# Altium schematic sheet UpConverter.SchDoc
size A4; DocumentNumber: 8; SheetNumber: 8; SheetTotal: 9
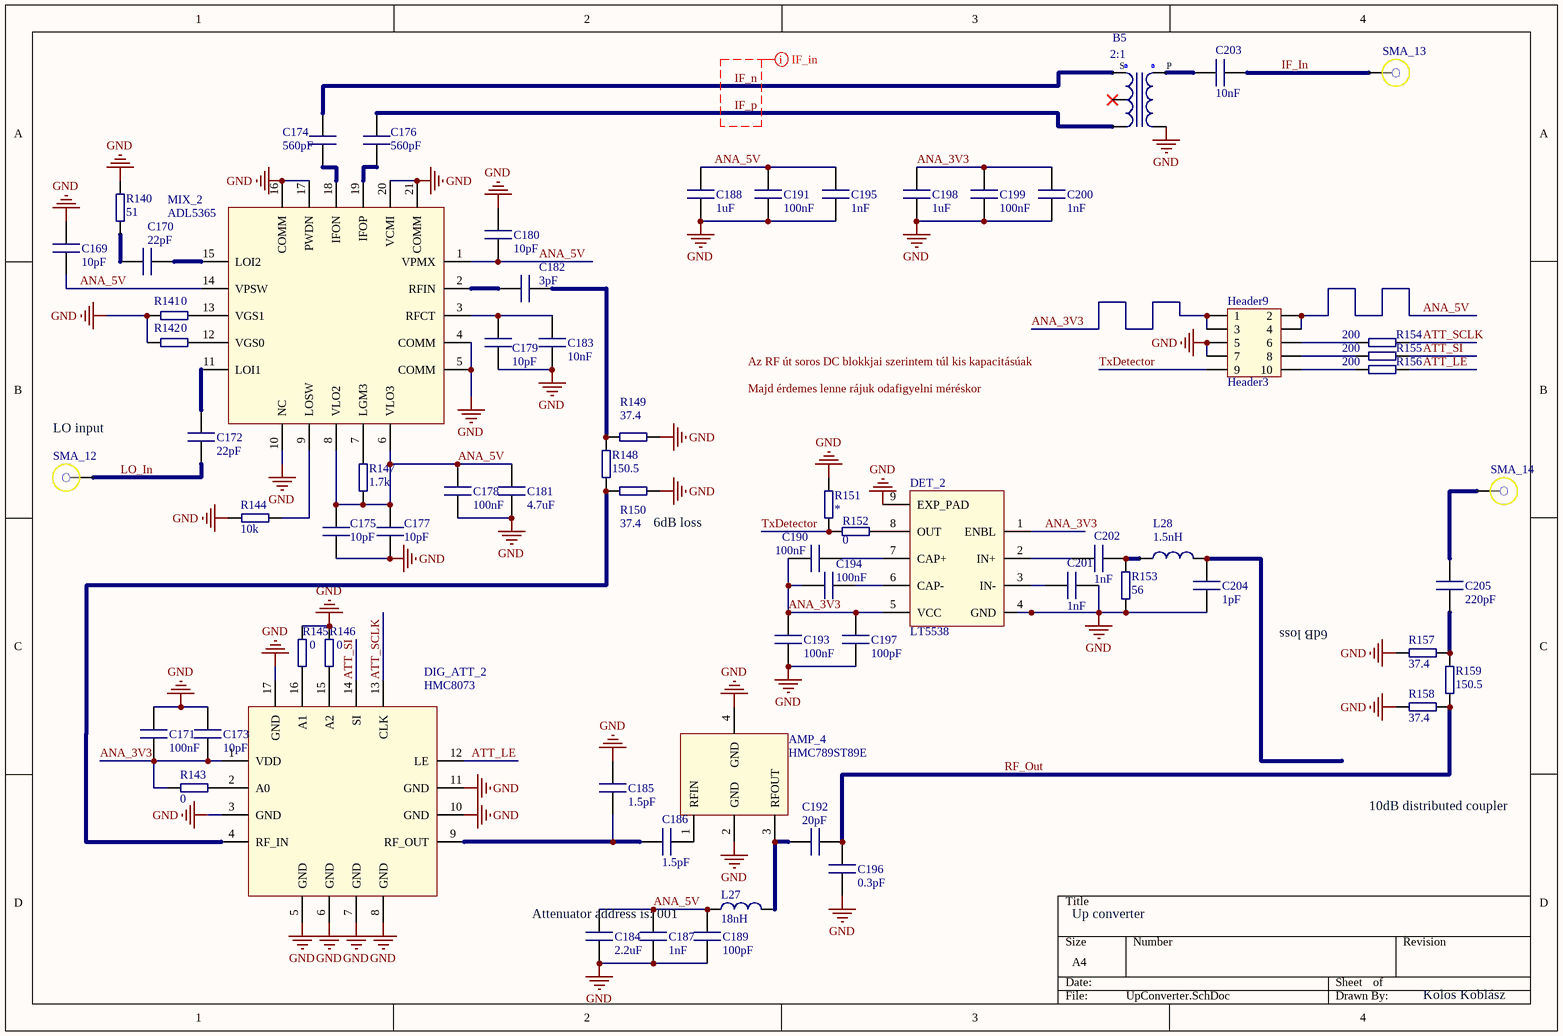
[diagram p0: UpConverter.SchDoc]

## Parts
AMP_4  HMC789ST89E
B5  ImpedanceTransformation P : S: 2:1  [Balun_Coil]  (hidden comment: Balun)
C169  value 10pF  [0805 SMD Passive]  (hidden comment: Cap1)
C170  value 22pF  [0805 SMD Passive]  (hidden comment: Cap1)
C171  value 100nF  [0805 SMD Passive]  (hidden comment: Cap1)
C172  value 22pF  [0805 SMD Passive]  (hidden comment: Cap1)
C173  value 10pF  [0805 SMD Passive]  (hidden comment: Cap1)
C174  value 560pF  [0805 SMD Passive]  (hidden comment: Cap1)
C175  value 10pF  [0805 SMD Passive]  (hidden comment: Cap1)
C176  value 560pF  [0805 SMD Passive]  (hidden comment: Cap1)
C177  value 10pF  [0805 SMD Passive]  (hidden comment: Cap1)
C178  value 100nF  [0805 SMD Passive]  (hidden comment: Cap1)
C179  value 10pF  [0805 SMD Passive]  (hidden comment: Cap1)
C180  value 10pF  [0805 SMD Passive]  (hidden comment: Cap1)
C181  value 4.7uF  [0805 SMD Passive]  (hidden comment: Cap1)
C182  value 3pF  [0805 SMD Passive]  (hidden comment: Cap1)
C183  value 10nF  [0805 SMD Passive]  (hidden comment: Cap1)
C184  value 2.2uF  [0805 SMD Passive]  (hidden comment: Cap1)
C185  value 1.5pF  [0805 SMD Passive]  (hidden comment: Cap1)
C186  value 1.5pF  [0805 SMD Passive]  (hidden comment: Cap1)
C187  value 1nF  [0805 SMD Passive]  (hidden comment: Cap1)
C188  value 1uF  [0805 SMD Passive]  (hidden comment: Cap1)
C189  value 100pF  [0805 SMD Passive]  (hidden comment: Cap1)
C190  value 100nF  [0805 SMD Passive]  (hidden comment: Cap1)
C191  value 100nF  [0805 SMD Passive]  (hidden comment: Cap1)
C192  value 20pF  [0805 SMD Passive]  (hidden comment: Cap1)
C193  value 100nF  [0805 SMD Passive]  (hidden comment: Cap1)
C194  value 100nF  [0805 SMD Passive]  (hidden comment: Cap1)
C195  value 1nF  [0805 SMD Passive]  (hidden comment: Cap1)
C196  value 0.3pF  [0805 SMD Passive]  (hidden comment: Cap1)
C197  value 100pF  [0805 SMD Passive]  (hidden comment: Cap1)
C198  value 1uF  [0805 SMD Passive]  (hidden comment: Cap1)
C199  value 100nF  [0805 SMD Passive]  (hidden comment: Cap1)
C200  value 1nF  [0805 SMD Passive]  (hidden comment: Cap1)
C201  value 1nF  [0805 SMD Passive]  (hidden comment: Cap1)
C202  value 1nF  [0805 SMD Passive]  (hidden comment: Cap1)
C203  value 10nF  [0805 SMD Passive]  (hidden comment: Cap1)
C204  value 1pF  [0805 SMD Passive]  (hidden comment: Cap1)
C205  value 220pF  [0805 SMD Passive]  (hidden comment: Cap1)
DET_2  LT5538
DIG_ATT_2  HMC8073
Header9  Header3  [Header3]
L27  value 18nH  [0805 SMD Passive]  (hidden comment: Inductor)
L28  value 1.5nH  [0805 SMD Passive]  (hidden comment: Inductor)
MIX_2  ADL5365
R140  value 51  [0805 SMD Passive]  (hidden comment: Resistor)
R141  value 0  [0805 SMD Passive]  (hidden comment: Resistor)
R142  value 0  [0805 SMD Passive]  (hidden comment: Resistor)
R143  value 0  [0805 SMD Passive]  (hidden comment: Resistor)
R144  value 10k  [0805 SMD Passive]  (hidden comment: Resistor)
R145  value 0  [0805 SMD Passive]  (hidden comment: Resistor)
R146  value 0  [0805 SMD Passive]  (hidden comment: Resistor)
R147  value 1.7k  [0805 SMD Passive]  (hidden comment: Resistor)
R148  value 150.5  [0805 SMD Passive]  (hidden comment: Resistor)
R149  value 37.4  [0805 SMD Passive]  (hidden comment: Resistor)
R150  value 37.4  [0805 SMD Passive]  (hidden comment: Resistor)
R151  Resistor  [0805 SMD Passive]  (value not drawn)
R152  value 0  [0805 SMD Passive]  (hidden comment: Resistor)
R153  value 56  [0805 SMD Passive]  (hidden comment: Resistor)
R154  value 200  [0805 SMD Passive]  (hidden comment: Resistor)
R155  value 200  [0805 SMD Passive]  (hidden comment: Resistor)
R156  value 200  [0805 SMD Passive]  (hidden comment: Resistor)
R157  value 37.4  [0805 SMD Passive]  (hidden comment: Resistor)
R158  value 37.4  [0805 SMD Passive]  (hidden comment: Resistor)
R159  value 150.5  [0805 SMD Passive]  (hidden comment: Resistor)
SMA_12  SMA1  [SMA Flange]  (value not drawn)
SMA_13  SMA1  [SMA Flange]  (value not drawn)
SMA_14  SMA1  [SMA Flange]  (value not drawn)

## Nets
GND: AMP_4.2(GND) AMP_4.4(GND) B5.4 C169.1 C171.2 C173.2 C175.1 C177.2 C178.1 C179.1 C180.1 C181.1 C183.1 C184.2 C185.1 C187.2 C188.1 C189.2 C191.1 C193.2 C195.1 C196.2 C197.2 C198.1 C199.1 C200.1 C201.1 C204.1 DET_2.4(GND) DET_2.9(EXP_PAD) DIG_ATT_2.3(GND) DIG_ATT_2.5(GND) DIG_ATT_2.6(GND) DIG_ATT_2.7(GND) DIG_ATT_2.8(GND) DIG_ATT_2.10(GND) DIG_ATT_2.11(GND) DIG_ATT_2.17(GND) Header9.5 Header9.7 MIX_2.4(COMM) MIX_2.5(COMM) MIX_2.10(NC) MIX_2.16(COMM) MIX_2.17(PWDN) MIX_2.20(VCMI) MIX_2.21(COMM) R140.1 R141.2 R142.2 R144.2 R145.2 R146.2 R149.2 R150.2 R151.2 R153.1 R157.2 R158.2
ANA_3V3: C171.1 C173.1 C190.2 C193.1 C194.2 C197.1 C198.2 C199.2 C200.2 DET_2.1(ENBL) DET_2.5(VCC) DIG_ATT_2.1(VDD) Header9.1 Header9.3 R143.2
ANA_5V: C169.2 C175.2 C177.1 C178.2 C180.2 C181.2 C184.1 C187.1 C188.2 C189.1 C191.2 C195.2 Header9.2 Header9.4 L27.2 MIX_2.1(VPMX) MIX_2.6(VLO3) MIX_2.8(VLO2) MIX_2.14(VPSW) R147.1
ATT_LE: DIG_ATT_2.12(LE) R156.1
ATT_SCLK: DIG_ATT_2.13(CLK) R154.1
ATT_SI: DIG_ATT_2.14(SI) R155.1
IF_In: C203.1 SMA_13.1
IF_n: B5.1 C174.1
IF_p: B5.3 C176.1
LO_In: C172.1 SMA_12.1
RF_Out: C192.2 C196.1 R158.1 R159.2
TxDetector: Header9.9 R151.1 R152.1
NetAMP_4_1: AMP_4.1(RFIN) C186.2
NetAMP_4_3: AMP_4.3(RFOUT) C192.1 L27.1
NetB5_5: B5.5 C203.2
NetC170_1: C170.1 R140.2
NetC170_2: C170.2 MIX_2.15(LOI2)
NetC172_2: C172.2 MIX_2.11(LOI1)
NetC174_2: C174.2 MIX_2.18(IFON)
NetC176_2: C176.2 MIX_2.19(IFOP)
NetC179_2: C179.2 C183.2 MIX_2.3(RFCT)
NetC182_1: C182.1 R148.1 R149.1
NetC182_2: C182.2 MIX_2.2(RFIN)
NetC185_2: C185.2 C186.1 DIG_ATT_2.9(RF_OUT)
NetC190_1: C190.1 DET_2.7(CAP+)
NetC194_1: C194.1 DET_2.6(CAP-)
NetC201_2: C201.2 DET_2.3(IN-)
NetC202_1: C202.1 L28.2 R153.2
NetC202_2: C202.2 DET_2.2(IN+)
NetC204_2: C204.2 L28.1
NetC205_1: C205.1 R157.1 R159.1
NetC205_2: C205.2 SMA_14.1
NetDET_2_8: DET_2.8(OUT) R152.2
NetDIG_ATT_2_2: DIG_ATT_2.2(A0) R143.1
NetDIG_ATT_2_4: DIG_ATT_2.4(RF_IN) R148.2 R150.1
NetDIG_ATT_2_15: DIG_ATT_2.15(A2) R146.1
NetDIG_ATT_2_16: DIG_ATT_2.16(A1) R145.1
NetHeader9_6: Header9.6 R154.2
NetHeader9_8: Header9.8 R155.2
NetHeader9_10: Header9.10 R156.2
NetMIX_2_7: MIX_2.7(LGM3) R147.2
NetMIX_2_9: MIX_2.9(LOSW) R144.1
NetMIX_2_12: MIX_2.12(VGS0) R142.1
NetMIX_2_13: MIX_2.13(VGS1) R141.1

Not connected (* = marked no-connect by the designer): B5 2*

## Layout directives
net class ADC_DataBus: IF_n, IF_p

## Notes on the sheet
- (near SMA_12) LO input
- (near R150) 6dB loss
- (near R157) 6dB loss
- 10dB distributed coupler
- (near DIG_ATT_2) Attenuator address is: 001
- Up converter
- Kolos Koblász
- Labels drawn without touching a wire or pin: Az RF út soros DC blokkjai szerintem túl kis kapacitásúak, Majd érdemes lenne rájuk odafigyelni méréskor
- (in symbol Balun1) S; P

## Library data of the parts
AMP_4 = HMC789ST89E: Gain Block MMIC; Manufacturer: Analog Devices; Package Description: SOT89; Order Code: HMC789ST89E; PartNumber: HMC789ST89E
B5 = Balun1: SMD Balun; MaxFrequency: 500MHz; MinFrequency: 5MHz; FootPrint: SMD; Manufacturer: *; PartNumber: *
C169-C205 = Cap1: SMD Capacitor; Precision: 1%; MaxVolt: 16V; FootPrint: *
DET_2 = LT5538: Detector; Manufacturer: Analog Devices; Order Code: LT5538IDD#PBF; Package Description: 8-Lead Plastic DFN; PartNumber: LT5538
DIG_ATT_2 = HMC8073: Digital Attenuator; Manufacturer: Analog Devices; Order Code: HMC8073LP3DE; Package Description: 16-Lead LFCSP; PartNumber: HMC8073
Header9 = Header3: 10 pin DIL header; PinNumber: 10; Row: 2; Pitch: 2.54mm; Type: Straight
L27 L28 = Ind1: SMD Inductor; Precision: 10%; MaxCurent: 100mA; FootPrint: SMD
MIX_2 = ADL5365: RF Mixer; Manufacturer: Analog Devices; Order Code: ADL5365ACPZ-R7; Package Description: 20-Lead LFCSP_WQ; PartNumber: ADL5365
R140-R159 = Res1: SMD Resistor; Precision: 1%; MaxPower: 0.1W; FootPrint: SMD
  R151: Value: *
SMA_12-SMA_14 = SMA1: SMA Female; Shape: 90°; Footprint: *; PartNumber: *; Manufacturer: *; OrderCode: *; Mounting: TroughHole